# Altium schematic sheet Top.SchDoc: DC-DC_12V-5V
size A4; Revision: V1.2; SheetNumber: 1; SheetTotal: 1
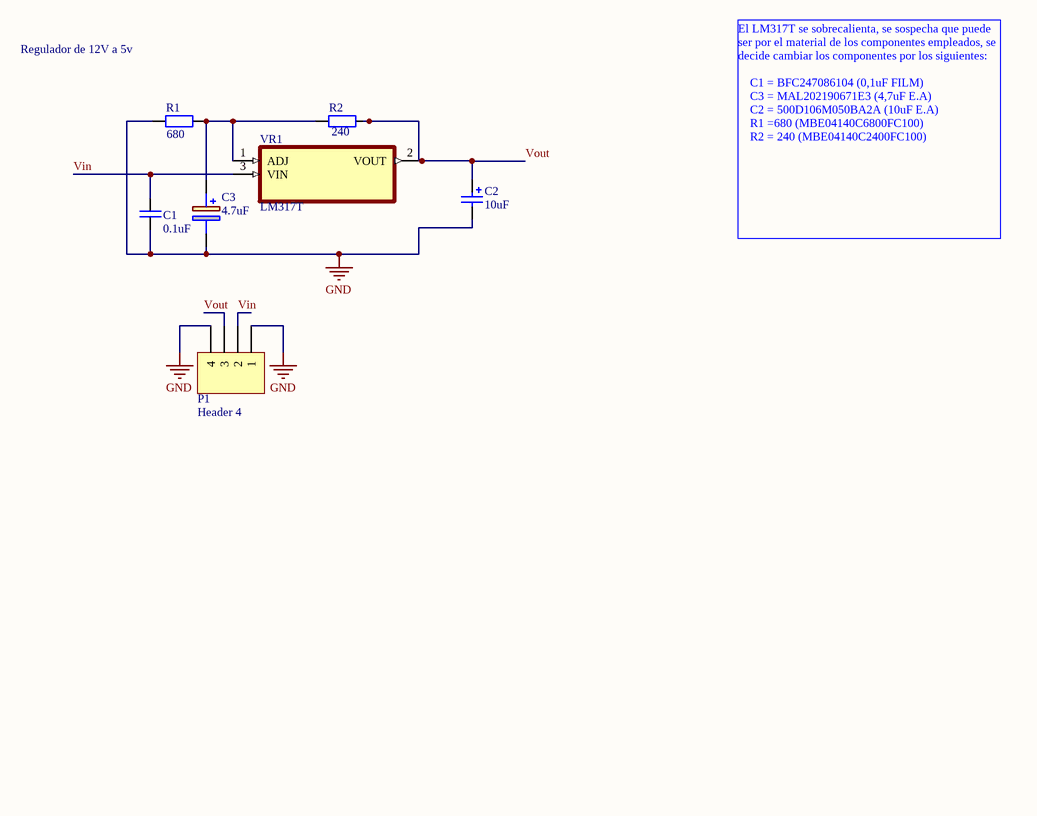
[diagram p0: Top.SchDoc]

## Parts
C1  0.1uF  [CAP_RADIAL_5mm]
C2  value 10uF  [POLAR0.8]  (hidden comment: 500D106M050BA2A)
C3  4.7uF  [CAP_AXIAL]
P1  Header 4  [HDR1X4]
R1  value 680  [AXIAL-0.4]  (hidden comment: MBE04140C6800FC100)
R2  value 240  [AXIAL-0.4]  (hidden comment: MBE04140C2400FC100)
VR1  LM317T  [TO254P1054X470X1955-3]

## Nets
GND: C1.2 C2.2 C3.2(-) P1.1 P1.4 R1.1
Vin: C1.1 P1.2 VR1.3(VIN)
Vout: C2.1 P1.3 R2.2 VR1.2(VOUT)
NetC3_1: C3.1(+) R1.2 R2.1 VR1.1(ADJ)

## Notes on the sheet
- Regulador de 12V a 5v
- El LM317T se sobrecalienta, se sospecha que puede ser por el material de los componentes empleados, se decide cambiar los componentes por los siguientes:
  C1 = BFC247086104 (0,1uF FILM)
  C3 = MAL202190671E3 (4,7uF E.A)
  C2 =	500D106M050BA2A (10uF E.A)
  R1 =680 (MBE04140C6800FC100)
  R2 = 240 (MBE04140C2400FC100)

## Library data of the parts
C1 = BFC247086104: Condensadores de película .1uF 5% 100volts; MF: Vishay; MP: CRCW06034K70FKEA; SnapEDA_Link: https://www.snapeda.com/parts/CRCW06034K70FKEA/Vishay+Dale/view-part/?ref=snap; Package: 1508 Vishay; Value: *; Check_prices: https://www.snapeda.com/parts/CRCW06034K70FKEA/Vishay+Dale/view-part/?ref=eda
C2 = Cap Pol2: Polarized Capacitor (Axial); Published: 8-Jun-2000; LatestRevisionDate: 17-Jul-2002; LatestRevisionNote: Re-released for DXP Platform.; PackageReference: POLAR0.8; Publisher: Altium Limited; PackageDescription: Polarized Capacitor; 2 Leads
C3 = MAL202190671E3: Condensadores electrolíticos de aluminio (con terminales axiales) 4.7uF 63V 20%; Manufacturer_Name: Vishay; Manufacturer_Part_Number: MAL214699104E3; Geometry.Height: 12.5mm; Mouser Part Number: 594-MAL214699104E3; Mouser Price/Stock: https://www.mouser.co.uk/ProductDetail/Vishay-BC-Components/MAL214699104E3?qs=Ep9Lwju7gVqvyEnQ0FJ4Qg%3D%3D; Datasheet Link: https://www.vishay.com/docs/28403/146cti.pdf
P1 = Header 4: Header, 4-Pin; LatestRevisionDate: 17-Jul-2002; LatestRevisionNote: Re-released for DXP Platform.; Publisher: Altium Limited
R1 R2 = Res2: Resistor; Published: 8-Jun-2000; LatestRevisionDate: 17-Jul-2002; LatestRevisionNote: Re-released for DXP Platform.; PackageReference: AXIAL-0.4; Publisher: Altium Limited; PackageDescription: Axial Device, Thru-Hole; 2 Leads; 0.4 in Pin Spacing
VR1 = LM317T: 1.5-A, 40-V, adjustable linear voltage regulator 3-TO-220; MF: Texas Instruments; SnapEDA_Link: https://www.snapeda.com/parts/LM317T/Texas+Instruments/view-part/?ref=snap; Package: TO-220-3 Texas Instruments; Value: *; MP: LM317T; Check_prices: https://www.snapeda.com/parts/LM317T/Texas+Instruments/view-part/?ref=eda